# Altium schematic sheet 0270_GDDR6 VDD POL VREG.SchDoc
size 848 x 558 mm
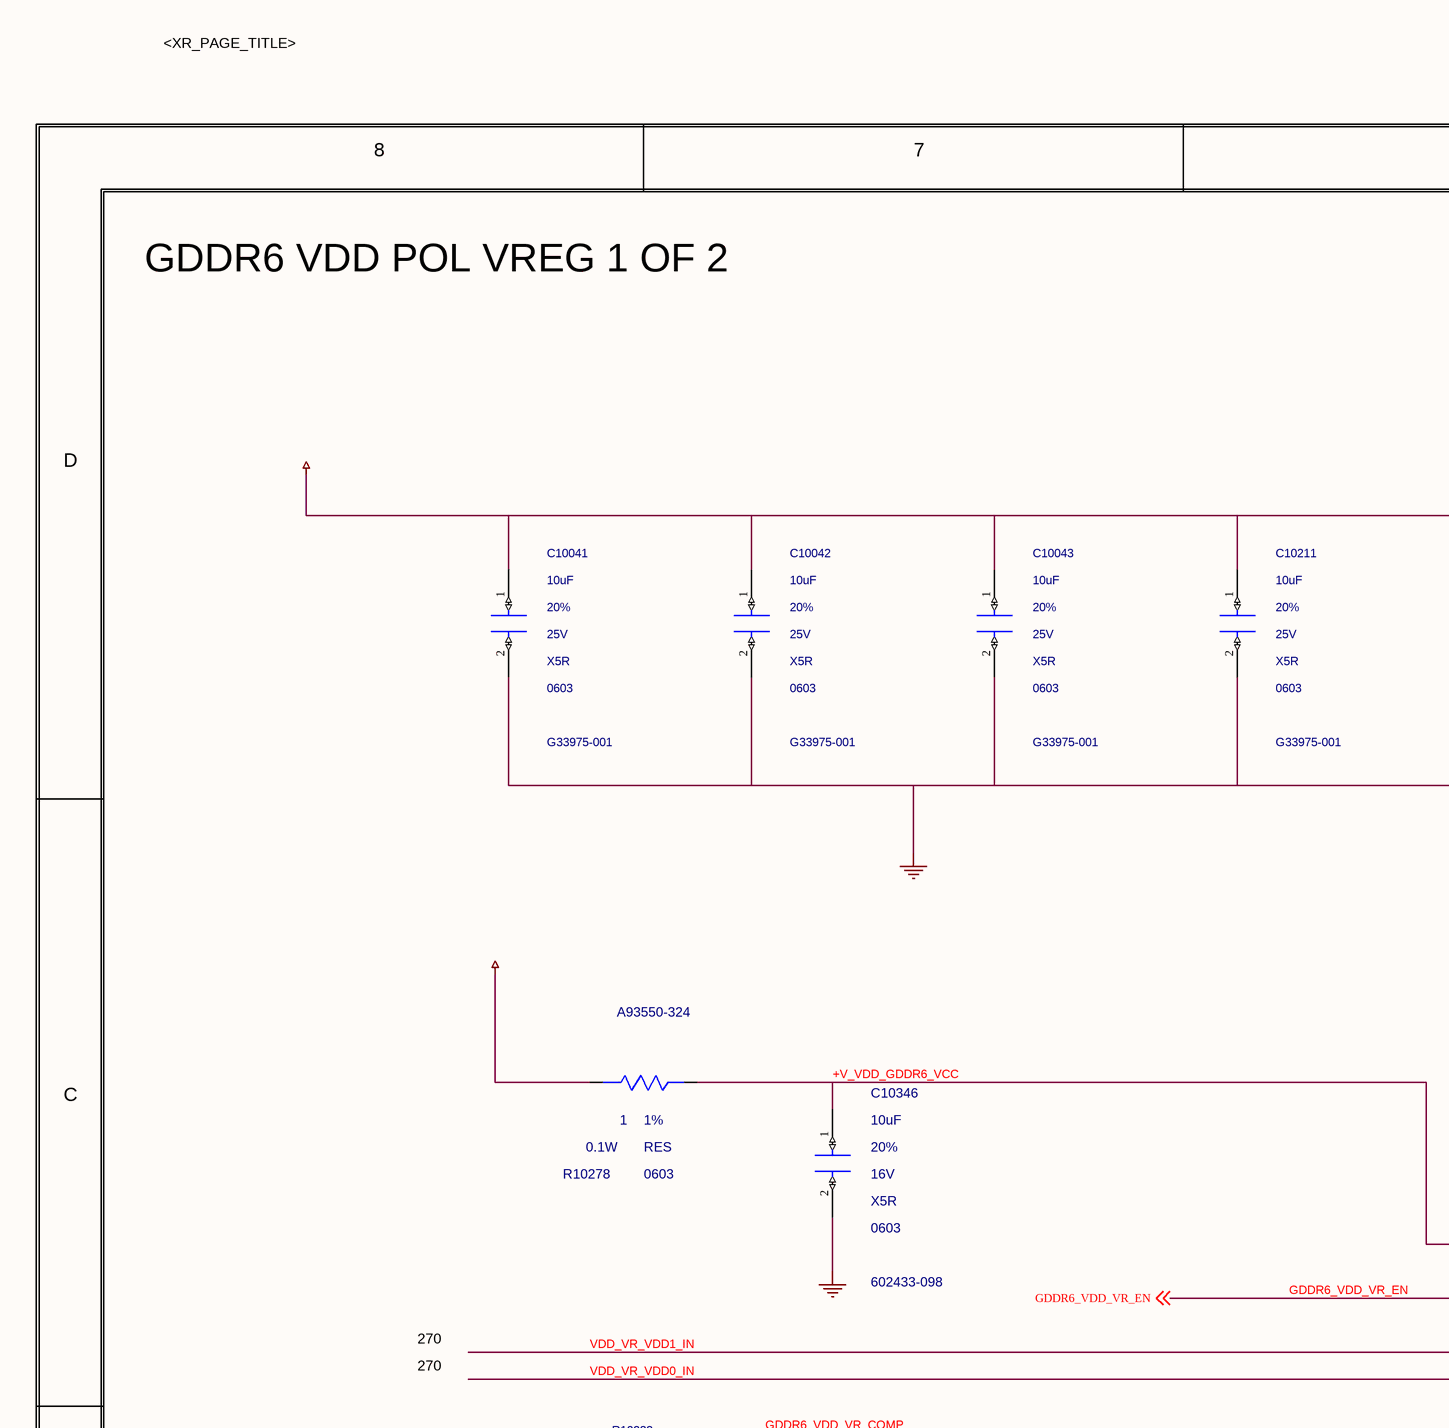
[diagram p0: 0270_GDDR6 VDD POL VREG.SchDoc, top left]
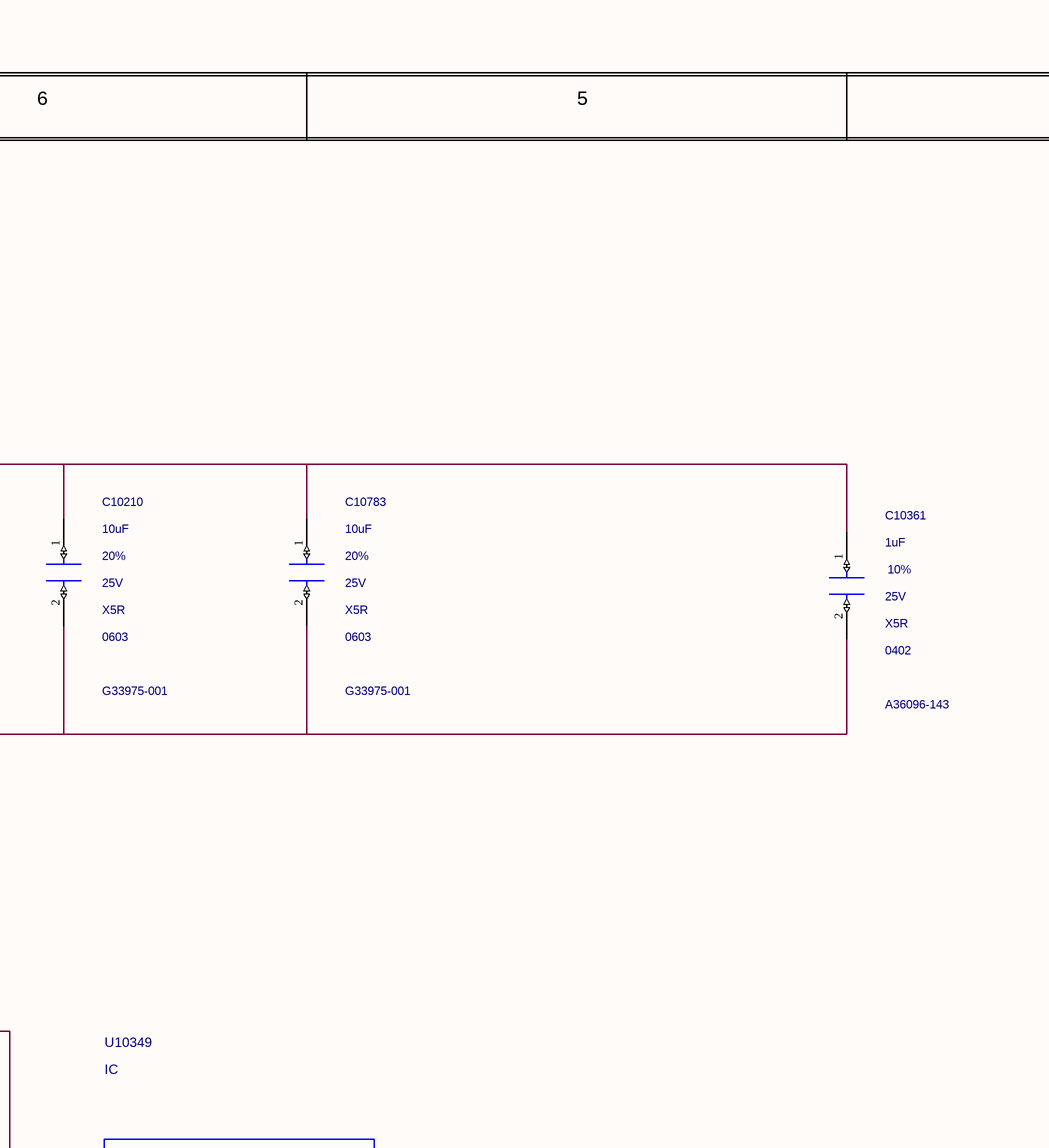
[diagram p1: 0270_GDDR6 VDD POL VREG.SchDoc, top middle]
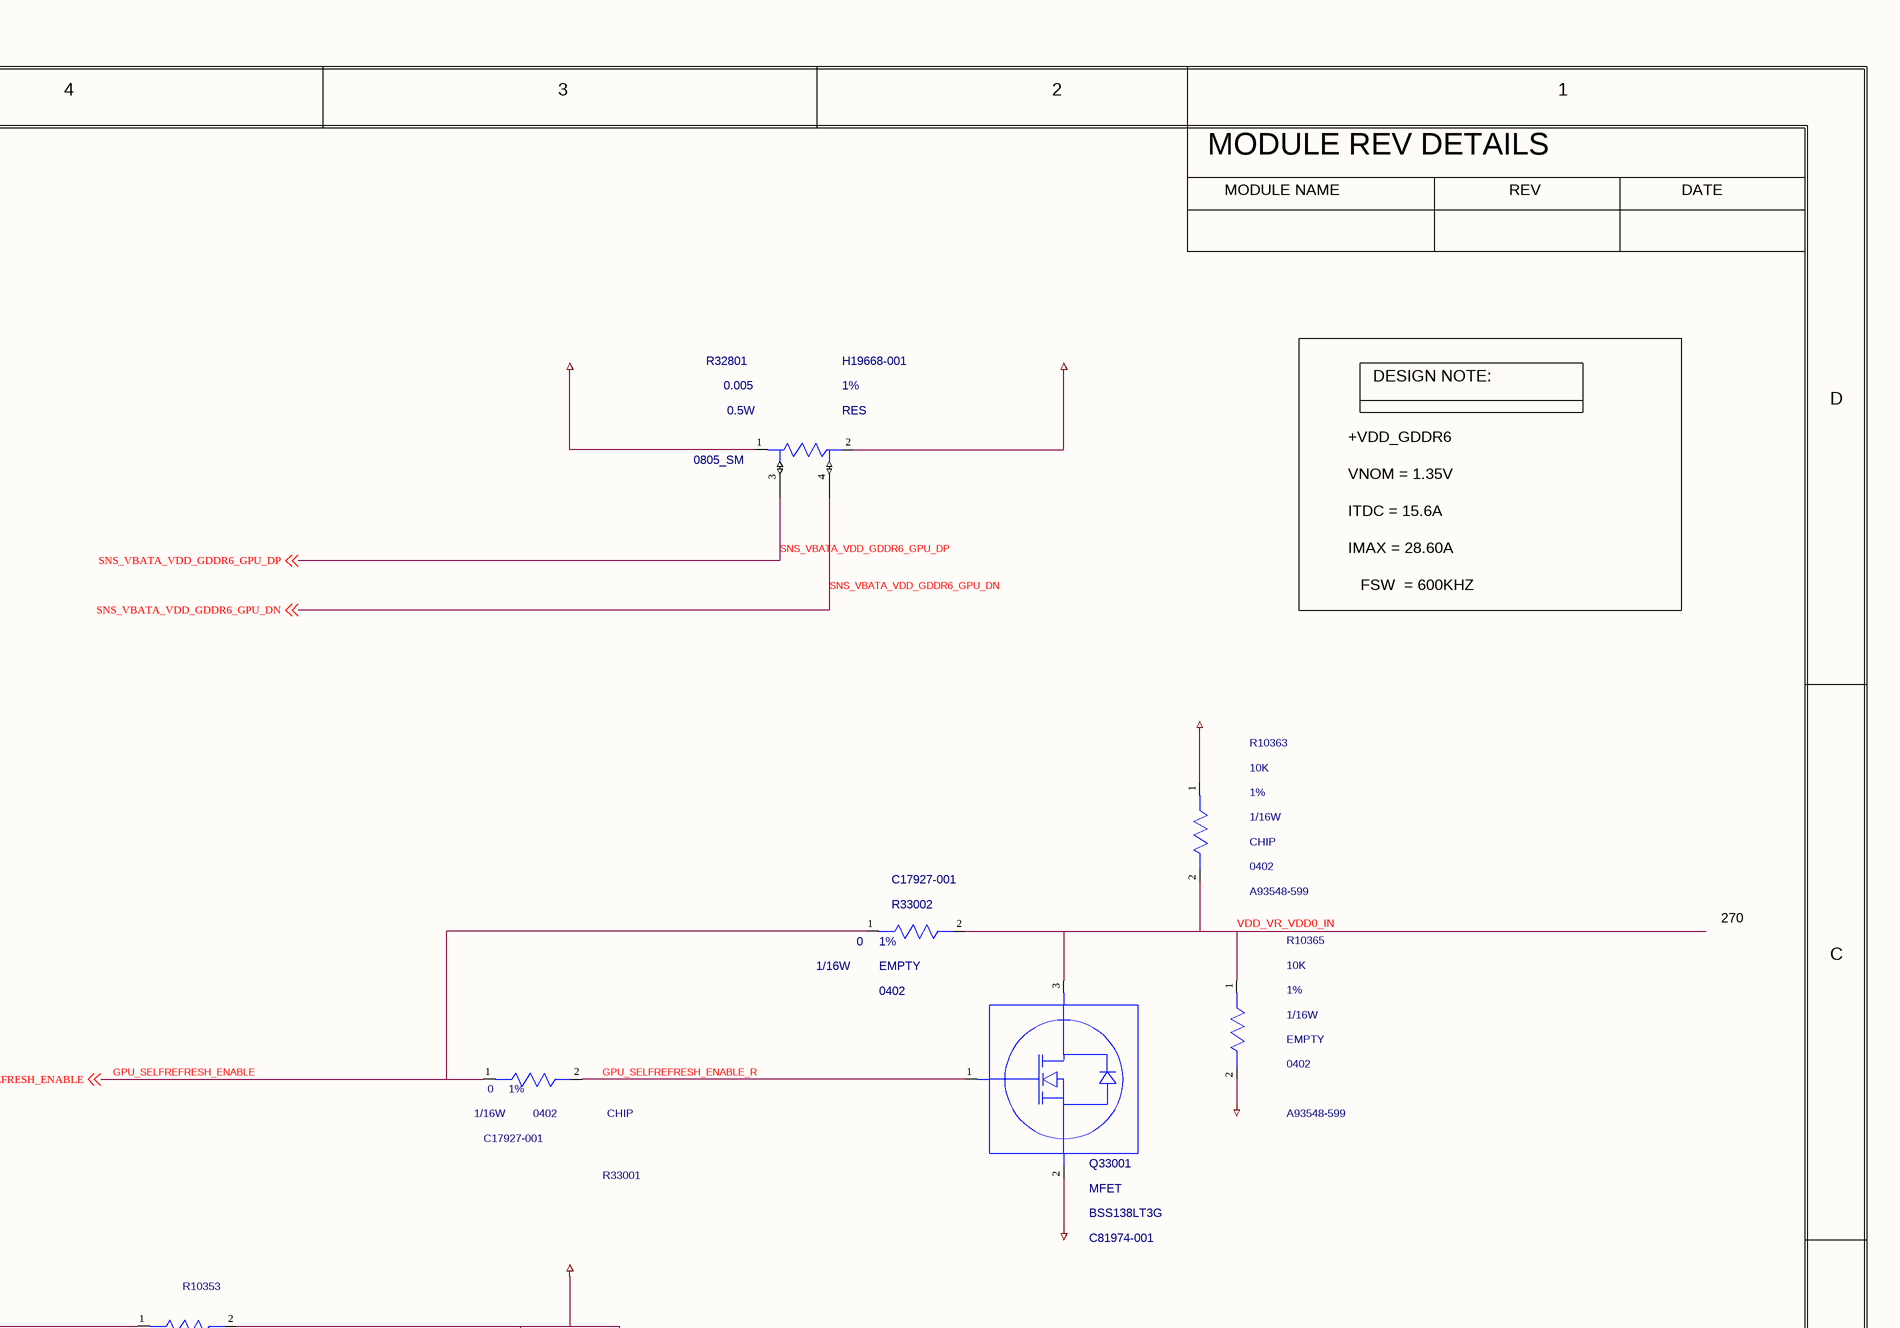
[diagram p2: 0270_GDDR6 VDD POL VREG.SchDoc, top right]
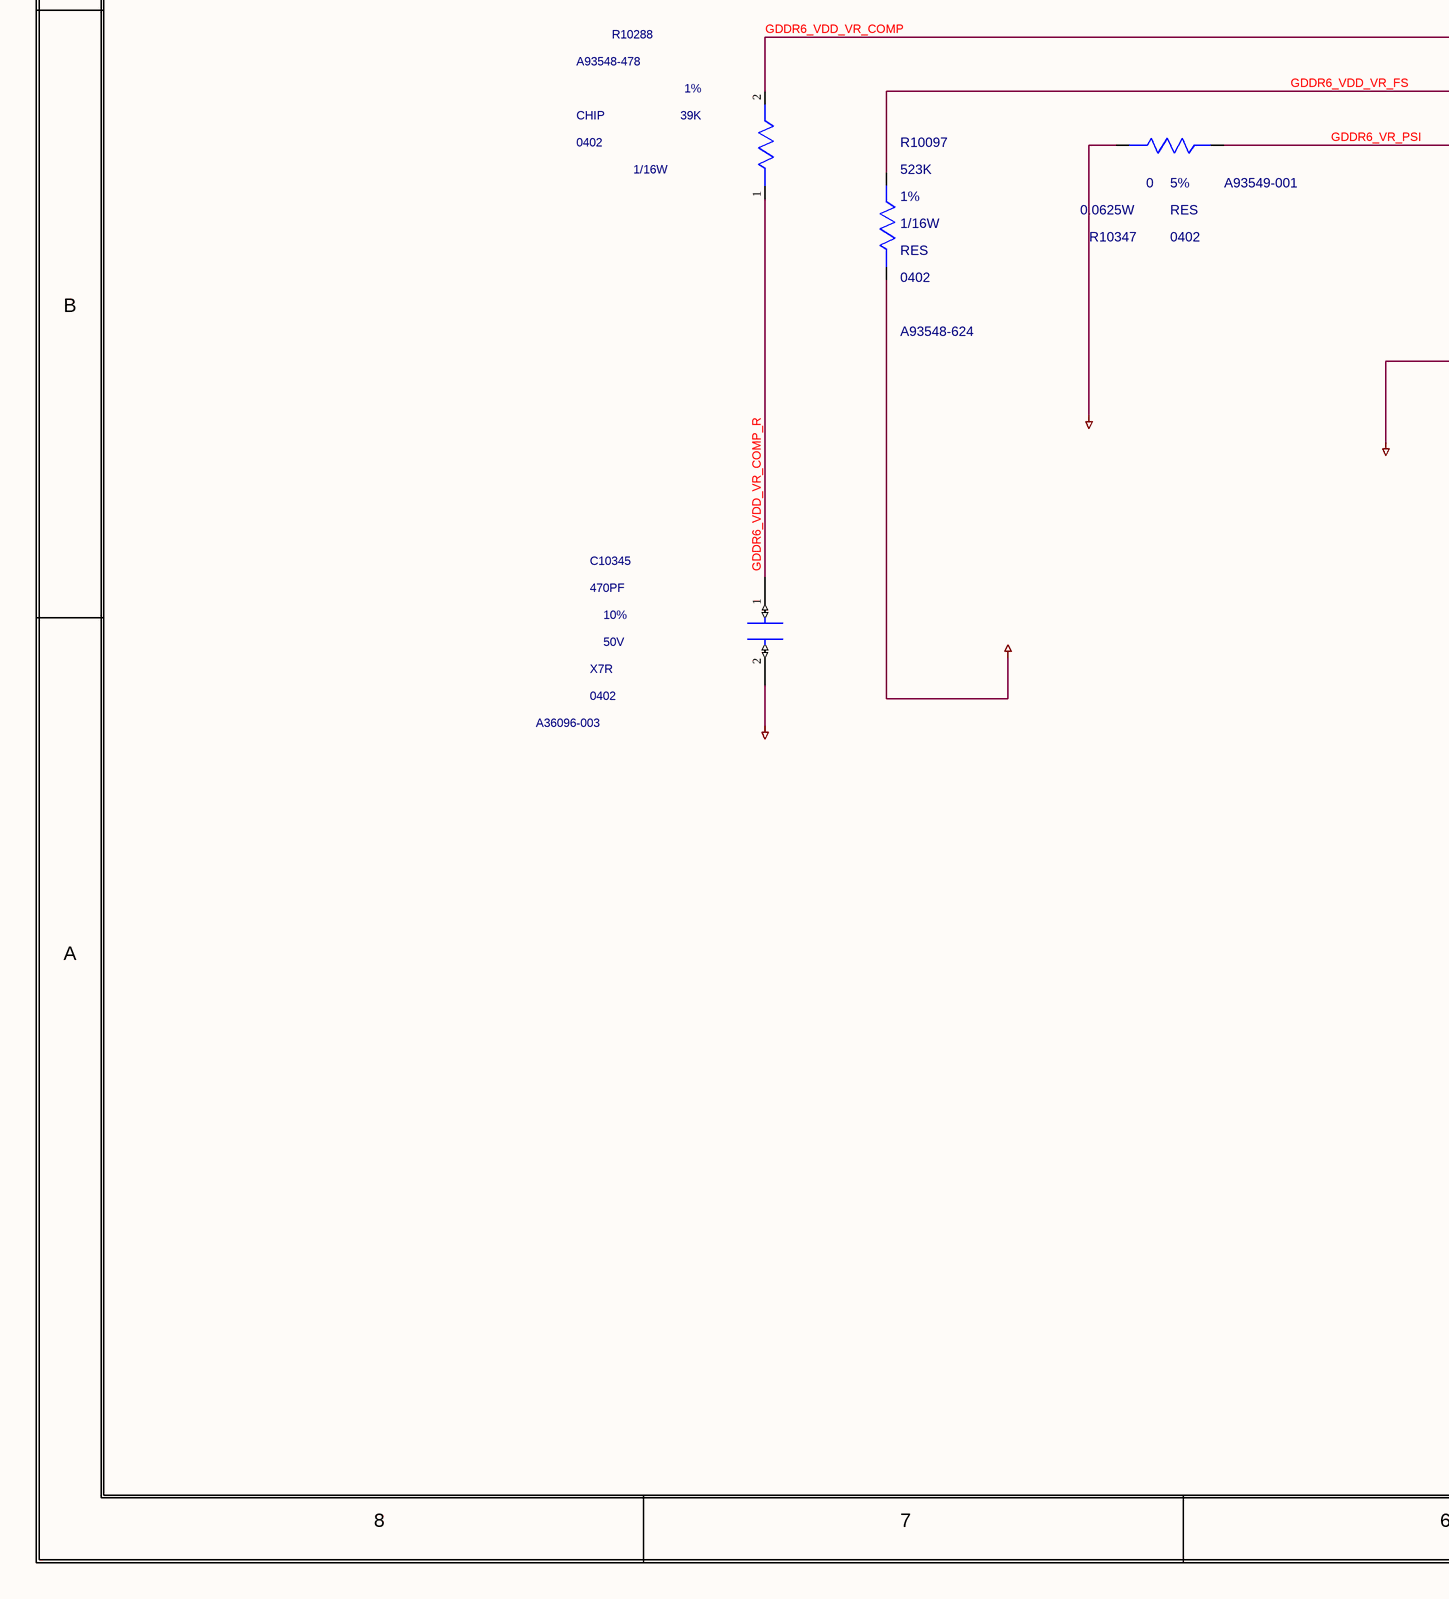
[diagram p3: 0270_GDDR6 VDD POL VREG.SchDoc, bottom left]
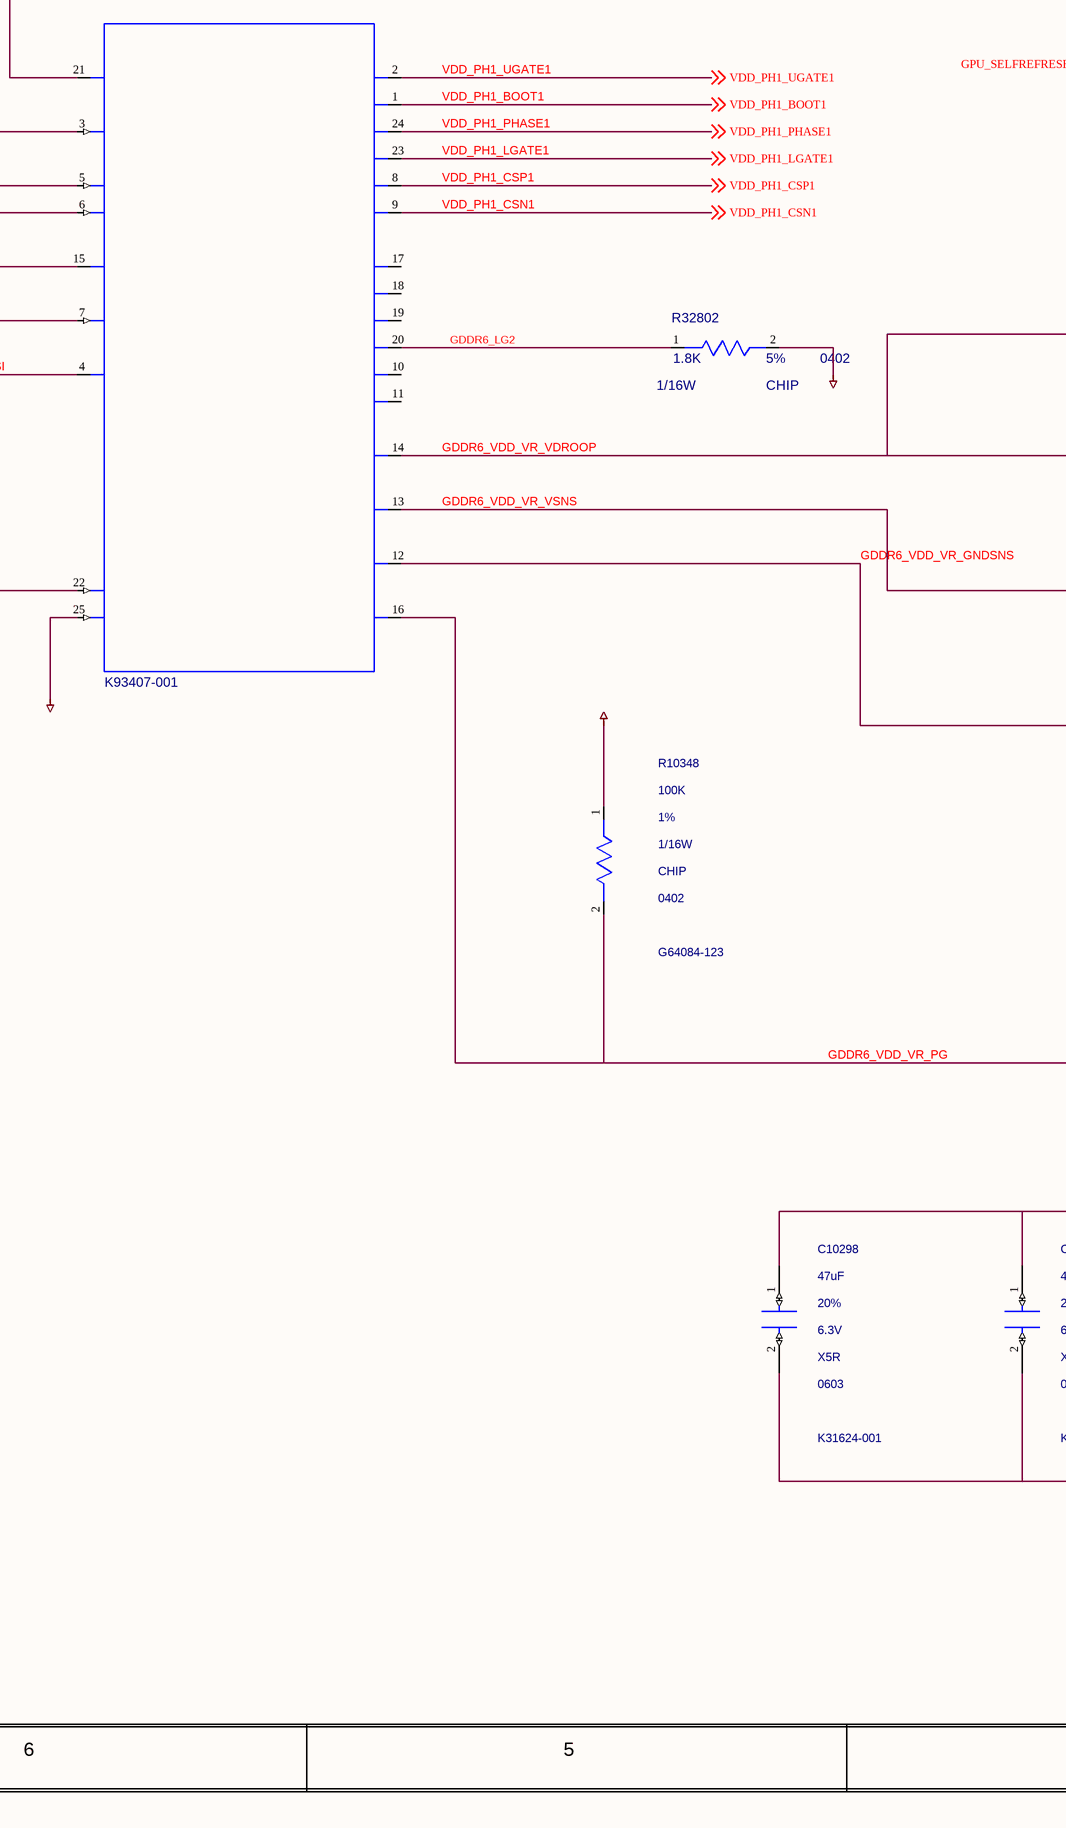
[diagram p4: 0270_GDDR6 VDD POL VREG.SchDoc, bottom middle]
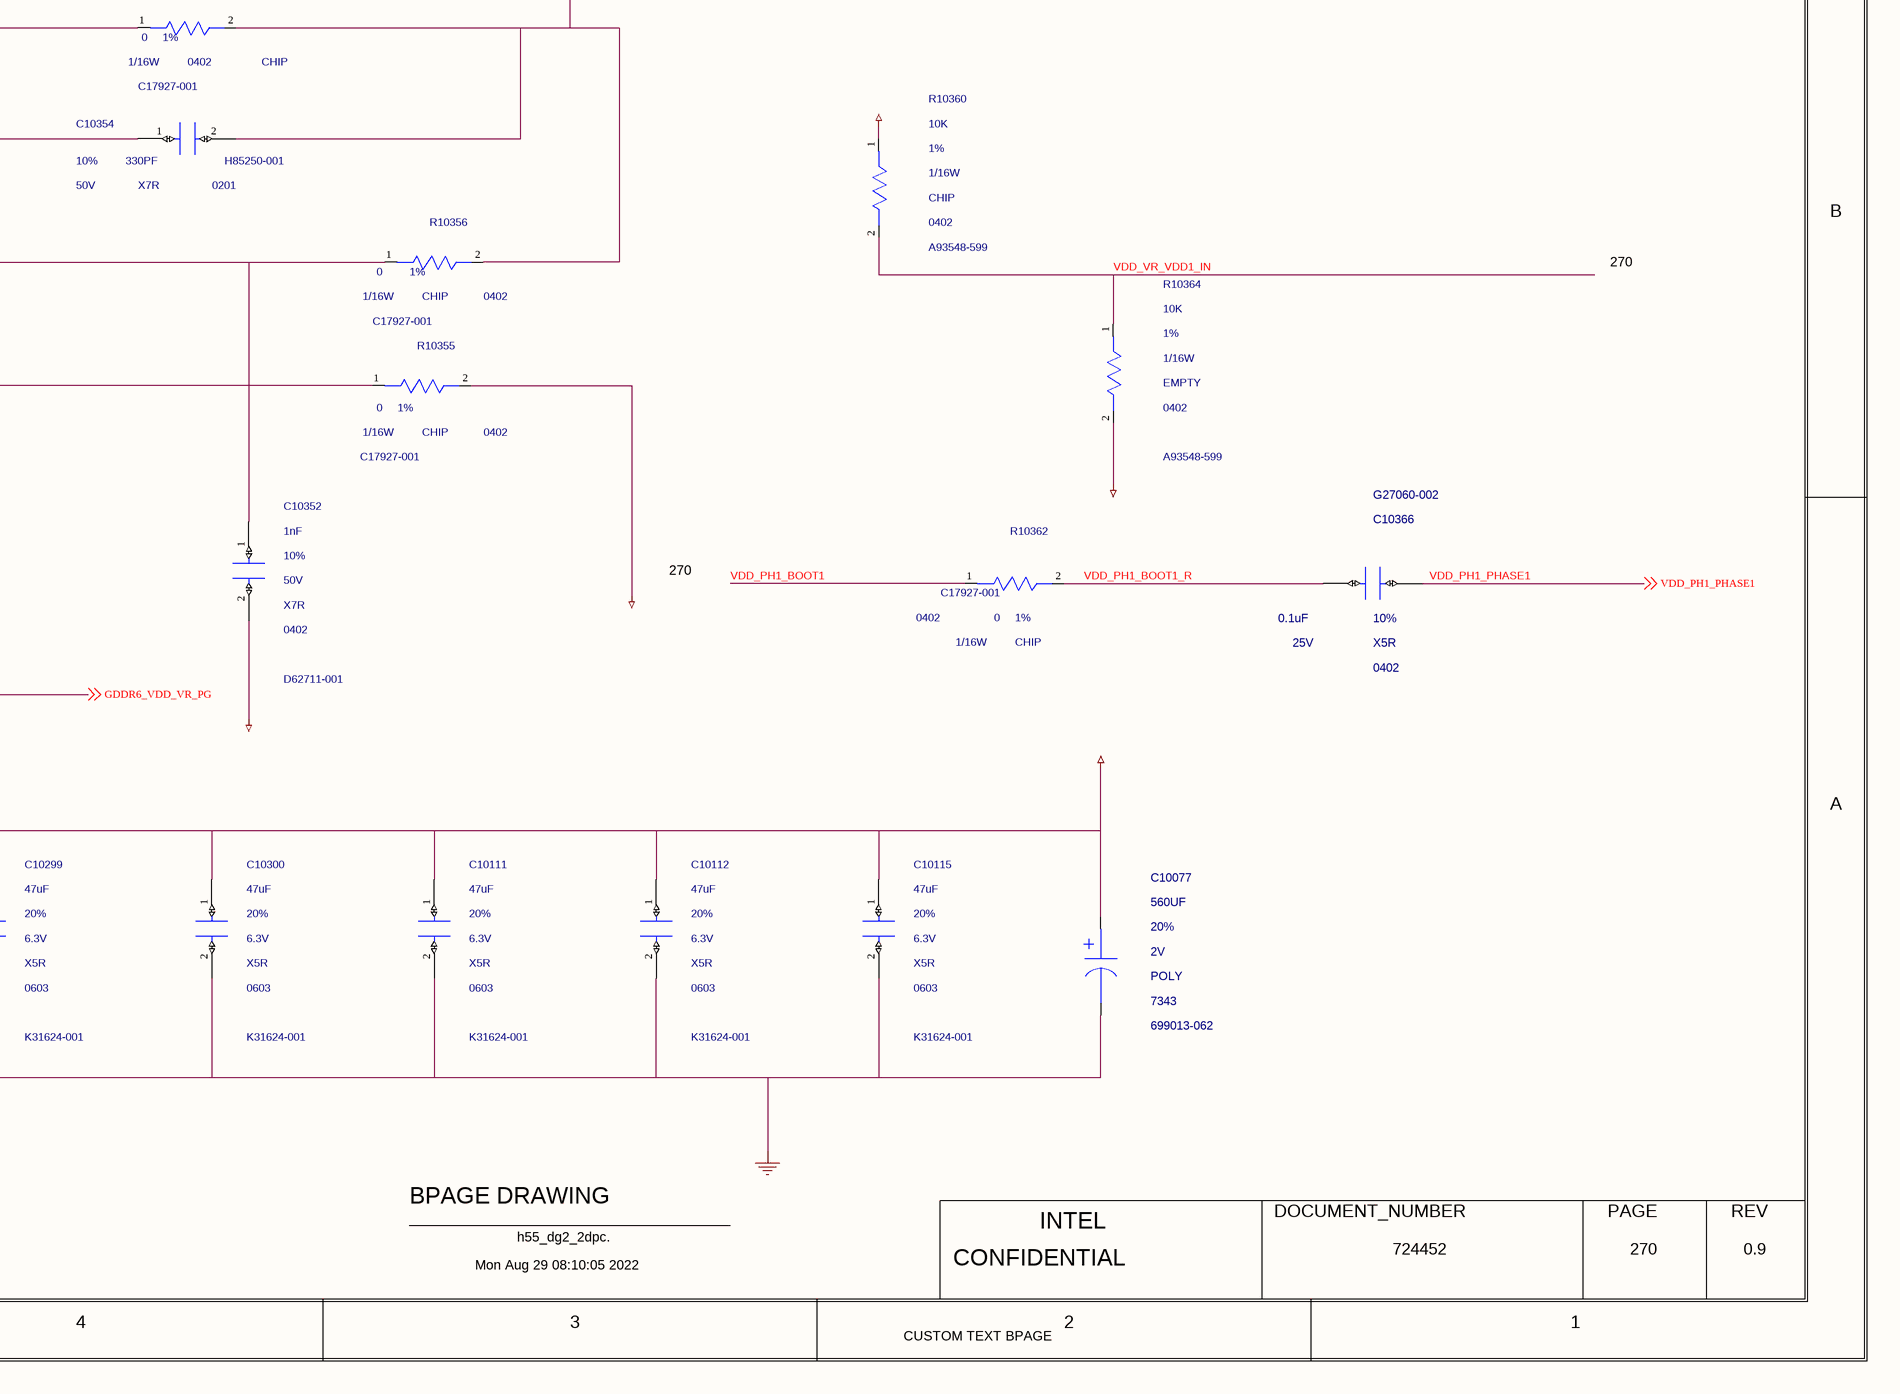
[diagram p5: 0270_GDDR6 VDD POL VREG.SchDoc, bottom right]

## Parts
C10041  10uF  MATERIAL: X5R  PACK_TYPE: 0603  PART_NUMBER: G33975-001  TOLERANCE: 20%  VOLTAGE: 25V  [SMC0603IA]
C10042  10uF  MATERIAL: X5R  PACK_TYPE: 0603  PART_NUMBER: G33975-001  TOLERANCE: 20%  VOLTAGE: 25V  [SMC0603IA]
C10043  10uF  MATERIAL: X5R  PACK_TYPE: 0603  PART_NUMBER: G33975-001  TOLERANCE: 20%  VOLTAGE: 25V  [SMC0603IA]
C10077  560UF  MATERIAL: POLY  PACK_TYPE: 7343  PART_NUMBER: 699013-062  TOLERANCE: 20%  VOLTAGE: 2V  [CTK2_SMC7343M_7500X4500_TANT_MA]
C10111  47uF  MATERIAL: X5R  PACK_TYPE: 0603  PART_NUMBER: K31624-001  TOLERANCE: 20%  VOLTAGE: 6.3V  [SMC0603ID]
C10112  47uF  MATERIAL: X5R  PACK_TYPE: 0603  PART_NUMBER: K31624-001  TOLERANCE: 20%  VOLTAGE: 6.3V  [SMC0603ID]
C10115  47uF  MATERIAL: X5R  PACK_TYPE: 0603  PART_NUMBER: K31624-001  TOLERANCE: 20%  VOLTAGE: 6.3V  [SMC0603ID]
C10210  10uF  MATERIAL: X5R  PACK_TYPE: 0603  PART_NUMBER: G33975-001  TOLERANCE: 20%  VOLTAGE: 25V  [SMC0603IA]
C10211  10uF  MATERIAL: X5R  PACK_TYPE: 0603  PART_NUMBER: G33975-001  TOLERANCE: 20%  VOLTAGE: 25V  [SMC0603IA]
C10298  47uF  MATERIAL: X5R  PACK_TYPE: 0603  PART_NUMBER: K31624-001  TOLERANCE: 20%  VOLTAGE: 6.3V  [SMC0603ID]
C10299  47uF  MATERIAL: X5R  PACK_TYPE: 0603  PART_NUMBER: K31624-001  TOLERANCE: 20%  VOLTAGE: 6.3V  [SMC0603ID]
C10300  47uF  MATERIAL: X5R  PACK_TYPE: 0603  PART_NUMBER: K31624-001  TOLERANCE: 20%  VOLTAGE: 6.3V  [SMC0603ID]
C10345  470PF  MATERIAL: X7R  PACK_TYPE: 0402  PART_NUMBER: A36096-003  TOLERANCE: 10%  VOLTAGE: 50V  [SMC0402IA]
C10346  10uF  MATERIAL: X5R  PACK_TYPE: 0603  PART_NUMBER: 602433-098  TOLERANCE: 20%  VOLTAGE: 16V  [SMC0603IA]
C10352  1nF  MATERIAL: X7R  PACK_TYPE: 0402  PART_NUMBER: D62711-001  TOLERANCE: 10%  VOLTAGE: 50V  [SMC0402IA]
C10354  330PF  MATERIAL: X7R  PACK_TYPE: 0201  PART_NUMBER: H85250-001  TOLERANCE: 10%  VOLTAGE: 50V  [SMC0201MB]
C10361  1uF  MATERIAL: X5R  PACK_TYPE: 0402  PART_NUMBER: A36096-143  TOLERANCE: 10%  VOLTAGE: 25V  [SMC0402MA]
C10366  0.1uF  MATERIAL: X5R  PACK_TYPE: 0402  PART_NUMBER: G27060-002  TOLERANCE: 10%  VOLTAGE: 25V  [CTK2_SM0402_1050X550_MA]
C10783  10uF  MATERIAL: X5R  PACK_TYPE: 0603  PART_NUMBER: G33975-001  TOLERANCE: 20%  VOLTAGE: 25V  [SMC0603IA]
Q33001  BSS138LT3G  MATERIAL: MFET  PART_NUMBER: C81974-001  [CTK0_SOT23_1400X3040_950_MA]
R10097  523K  MATERIAL: RES  PACK_TYPE: 0402  PART_NUMBER: A93548-624  TOLERANCE: 1%  WATTAGE: 1/16W  [TK2_SM0402_1050X550_MA]
R10278  1  MATERIAL: RES  PACK_TYPE: 0603  PART_NUMBER: A93550-324  TOLERANCE: 1%  WATTAGE: 0.1W  [CTK2_SM0603_1800X900_MA]
R10288  39K  MATERIAL: CHIP  PACK_TYPE: 0402  PART_NUMBER: A93548-478  TOLERANCE: 1%  WATTAGE: 1/16W  [SMR0402IA]
R10347  0  MATERIAL: RES  PACK_TYPE: 0402  PART_NUMBER: A93549-001  TOLERANCE: 5%  WATTAGE: 0.0625W  [CTK2_SM0402_1100X550_MA]
R10348  100K  MATERIAL: CHIP  PACK_TYPE: 0402  PART_NUMBER: G64084-123  TOLERANCE: 1%  WATTAGE: 1/16W  [SMR0402IA]
R10353  0  MATERIAL: CHIP  PACK_TYPE: 0402  PART_NUMBER: C17927-001  TOLERANCE: 1%  WATTAGE: 1/16W  [SMR0402IA]
R10355  0  MATERIAL: CHIP  PACK_TYPE: 0402  PART_NUMBER: C17927-001  TOLERANCE: 1%  WATTAGE: 1/16W  [SMR0402IA]
R10356  0  MATERIAL: CHIP  PACK_TYPE: 0402  PART_NUMBER: C17927-001  TOLERANCE: 1%  WATTAGE: 1/16W  [SMR0402IA]
R10360  10K  MATERIAL: CHIP  PACK_TYPE: 0402  PART_NUMBER: A93548-599  TOLERANCE: 1%  WATTAGE: 1/16W  [SMR0402IA]
R10362  0  MATERIAL: CHIP  PACK_TYPE: 0402  PART_NUMBER: C17927-001  TOLERANCE: 1%  WATTAGE: 1/16W  [SMR0402IA]
R10363  10K  MATERIAL: CHIP  PACK_TYPE: 0402  PART_NUMBER: A93548-599  TOLERANCE: 1%  WATTAGE: 1/16W  [SMR0402IA]
R10364  10K  MATERIAL: EMPTY  PACK_TYPE: 0402  PART_NUMBER: A93548-599  TOLERANCE: 1%  WATTAGE: 1/16W  [SMR0402IA]
R10365  10K  MATERIAL: EMPTY  PACK_TYPE: 0402  PART_NUMBER: A93548-599  TOLERANCE: 1%  WATTAGE: 1/16W  [SMR0402IA]
R32801  0.005  MATERIAL: RES  PACK_TYPE: 0805_SM  PART_NUMBER: H19668-001  TOLERANCE: 1%  WATTAGE: 0.5W  [CTK2_SMR4_0805_2150X1350_MA]
R32802  1.8K  MATERIAL: CHIP  PACK_TYPE: 0402  TOLERANCE: 5%  WATTAGE: 1/16W  [SMR1005MD]
R33001  0  MATERIAL: CHIP  PACK_TYPE: 0402  PART_NUMBER: C17927-001  TOLERANCE: 1%  WATTAGE: 1/16W  [SMR0402IA]
R33002  0  MATERIAL: EMPTY  PACK_TYPE: 0402  PART_NUMBER: C17927-001  TOLERANCE: 1%  WATTAGE: 1/16W  [SMR0402IA]
U10349  MATERIAL: IC  PART_NUMBER: K93407-001  [TK0_LCC24_S4100_500_DFS2650_MA]  (hidden comment: APW8751_2)

## Nets
+V1P8S_GPU: R10348.1(A) R10360.1(A) R10363.1(A)
+V5A_L: R10278.1(A)
+VBATA_DG2: R32801.1(PWRA)
+VBATA_VDD_GDDR6: C10041.1(A) C10042.1(A) C10043.1(A) C10210.1(A) C10211.1(A) C10361.1(A) C10783.1(A) R10097.2(B) R32801.2(PWRB)
+VDD_GDDR6: C10077.1(A) C10111.1(A) C10112.1(A) C10115.1(A) C10298.1(A) C10299.1(A) C10300.1(A) C10354.2(B) R10353.2(B) R10356.2(B)
GND: C10041.2(B) C10042.2(B) C10043.2(B) C10077.2(B) C10111.2(B) C10112.2(B) C10115.2(B) C10210.2(B) C10211.2(B) C10298.2(B) C10299.2(B) C10300.2(B) C10345.2(B) C10346.2(B) C10352.2(B) C10361.2(B) C10783.2(B) Q33001.2(S) R10347.1(A) R10355.2(B) R10364.2(B) R10365.2(B) R32802.2(B) U10349.22(GND) U10349.25(PGND_TPD)
+V_VDD_GDDR6_VCC: C10346.1(A) R10278.2(B) U10349.21(VCC)
GDDR6_LG2: R32802.1(A) U10349.20(LGATE2)
GDDR6_VDD_VR_COMP: R10288.2(B) U10349.15(COMP)
GDDR6_VDD_VR_COMP_R: C10345.1(A) R10288.1(A)
GDDR6_VDD_VR_EN: U10349.3(EN) ; off-sheet GDDR6_VDD_VR_EN
GDDR6_VDD_VR_FS: R10097.1(A) U10349.7(FS)
GDDR6_VDD_VR_GNDSNS: R10355.1(A) U10349.12(GNDSNS)
GDDR6_VDD_VR_PG: R10348.2(B) U10349.16(POK) ; off-sheet GDDR6_VDD_VR_PG
GDDR6_VDD_VR_VDROOP: C10354.1(A) R10353.1(A) U10349.14(VDROOP)
GDDR6_VDD_VR_VSNS: C10352.1(A) R10356.1(A) U10349.13(VSNS)
GDDR6_VR_PSI: R10347.2(B) U10349.4(PSI)
GPU_SELFREFRESH_ENABLE: R33001.1(A) R33002.1(A) ; off-sheet GPU_SELFREFRESH_ENABLE
GPU_SELFREFRESH_ENABLE_R: Q33001.1(G) R33001.2(B)
SNS_VBATA_VDD_GDDR6_GPU_DN: R32801.4(SENB) ; off-sheet SNS_VBATA_VDD_GDDR6_GPU_DN
SNS_VBATA_VDD_GDDR6_GPU_DP: R32801.3(SENA) ; off-sheet SNS_VBATA_VDD_GDDR6_GPU_DP
VDD_PH1_BOOT1: R10362.1(A) U10349.1(BOOT1) ; off-sheet VDD_PH1_BOOT1
VDD_PH1_BOOT1_R: C10366.1(A) R10362.2(B)
VDD_PH1_CSN1: U10349.9(CSN1) ; off-sheet VDD_PH1_CSN1
VDD_PH1_CSP1: U10349.8(CSP1) ; off-sheet VDD_PH1_CSP1
VDD_PH1_LGATE1: U10349.23(LGATE1) ; off-sheet VDD_PH1_LGATE1
VDD_PH1_PHASE1: C10366.2(B) U10349.24(PHASE1) ; off-sheet VDD_PH1_PHASE1
VDD_PH1_UGATE1: U10349.2(UGATE1) ; off-sheet VDD_PH1_UGATE1
VDD_VR_VDD0_IN: Q33001.3(D) R10363.2(B) R10365.1(A) R33002.2(B) U10349.6(VID0)
VDD_VR_VDD1_IN: R10360.2(B) R10364.1(A) U10349.5(VID1)

Not connected (* = marked no-connect by the designer): U10349 10(CSP2) 11(CSN2) 17(UGATE2) 18(BOOT2) 19(PHASE2)

## Notes on the sheet
- <XR_PAGE_TITLE>
- 8
- 7
- 6
- 5
- 4
- 3
- 2
- 1
- MODULE REV DETAILS
- GDDR6 VDD POL VREG 1 OF 2
- MODULE NAME
- REV
- DATE
- D
- DESIGN NOTE:
- +VDD_GDDR6
- VNOM = 1.35V
- ITDC = 15.6A
- IMAX = 28.60A
- FSW  = 600KHZ
- 270
- C
- B
- A
- BPAGE DRAWING
- INTEL
- DOCUMENT_NUMBER
- PAGE
- Mon Aug 29 08:10:05 2022
- h55_dg2_2dpc.
- CONFIDENTIAL
- 724452
- 0.9
- CUSTOM TEXT BPAGE

## Library data of the parts
C10041 = CAP: CDS_PHYS_PART_NAME: CAP_0603-G33975-001,X5R,10UF,25V,20%,LPDB,GENERIC; OriginalSymbolOrigin: (-50,25); XY: (-7250,4200); VER: 1; ROT: 0; PHYS_PAGE: 270; LOCATION: C10041; DRAWING: @RVP1_ADL_SB_ADP_S_DDR5_SODIMM_2DPC_LIB.H55_DG2_2DPC(SCH_1):PAGE443; CDS_LIB: discrete; PCB Footprint: SMC0603IA; CHIPS_PART_NAME: CAP; CDS_PART_NAME: CAP_0603-G33975-001,X5R,10UF,25V,20%,LPDB,GENERIC; CDS_LOCATION: C10041
C10042 = CAP: CDS_PHYS_PART_NAME: CAP_0603-G33975-001,X5R,10UF,25V,20%,LPDB,GENERIC; OriginalSymbolOrigin: (-50,25); XY: (-6800,4200); VER: 1; ROT: 0; PHYS_PAGE: 270; LOCATION: C10042; DRAWING: @RVP1_ADL_SB_ADP_S_DDR5_SODIMM_2DPC_LIB.H55_DG2_2DPC(SCH_1):PAGE443; CDS_LIB: discrete; PCB Footprint: SMC0603IA; CHIPS_PART_NAME: CAP; CDS_PART_NAME: CAP_0603-G33975-001,X5R,10UF,25V,20%,LPDB,GENERIC; CDS_LOCATION: C10042
C10043 = CAP: CDS_PHYS_PART_NAME: CAP_0603-G33975-001,X5R,10UF,25V,20%,LPDB,GENERIC; OriginalSymbolOrigin: (-50,25); XY: (-6350,4200); VER: 1; ROT: 0; PHYS_PAGE: 270; LOCATION: C10043; DRAWING: @RVP1_ADL_SB_ADP_S_DDR5_SODIMM_2DPC_LIB.H55_DG2_2DPC(SCH_1):PAGE443; CDS_LIB: discrete; PCB Footprint: SMC0603IA; CHIPS_PART_NAME: CAP; CDS_PART_NAME: CAP_0603-G33975-001,X5R,10UF,25V,20%,LPDB,GENERIC; CDS_LOCATION: C10043
C10077 = C_CAPP: CDS_PHYS_PART_NAME: C_CAPP_7343-699013-062,POLY,560UF,2V,20%,TK2,GENERIC; CDS_LMAN_SYM_OUTLINE: -50,100,50,-50; FP_TECH: TK2; IP: GENERIC; ROOM: NONE; OriginalSymbolOrigin: (-50,75); XY: (-1425,675); VER: 1; ROT: 0; PHYS_PAGE: 270; LOCATION: C10077; DRAWING: @RVP1_ADL_SB_ADP_S_DDR5_SODIMM_2DPC_LIB.H55_DG2_2DPC(SCH_1):PAGE443; CDS_LIB: c_discrete; VARIANT: ?; PCB Footprint: CTK2_SMC7343M_7500X4500_TANT_MA; CHIPS_PART_NAME: C_CAPP; CDS_PART_NAME: C_CAPP_7343-699013-062,POLY,560UF,2V,20%,TK2,GENERIC; CDS_LOCATION: C10077
C10111 = CAP: CDS_PHYS_PART_NAME: CAP_0603-K31624-001,X5R,47UF,6.3V,20%,LPDB,GENERIC; OriginalSymbolOrigin: (-50,25); XY: (-2775,750); VER: 1; ROT: 0; PHYS_PAGE: 270; LOCATION: C10111; DRAWING: @RVP1_ADL_SB_ADP_S_DDR5_SODIMM_2DPC_LIB.H55_DG2_2DPC(SCH_1):PAGE443; CDS_LIB: discrete; PCB Footprint: SMC0603ID; CHIPS_PART_NAME: CAP; CDS_PART_NAME: CAP_0603-K31624-001,X5R,47UF,6.3V,20%,LPDB,GENERIC; CDS_LOCATION: C10111
C10112 = CAP: CDS_PHYS_PART_NAME: CAP_0603-K31624-001,X5R,47UF,6.3V,20%,LPDB,GENERIC; OriginalSymbolOrigin: (-50,25); XY: (-2325,750); VER: 1; ROT: 0; PHYS_PAGE: 270; LOCATION: C10112; DRAWING: @RVP1_ADL_SB_ADP_S_DDR5_SODIMM_2DPC_LIB.H55_DG2_2DPC(SCH_1):PAGE443; CDS_LIB: discrete; PCB Footprint: SMC0603ID; CHIPS_PART_NAME: CAP; CDS_PART_NAME: CAP_0603-K31624-001,X5R,47UF,6.3V,20%,LPDB,GENERIC; CDS_LOCATION: C10112
C10115 = CAP: CDS_PHYS_PART_NAME: CAP_0603-K31624-001,X5R,47UF,6.3V,20%,LPDB,GENERIC; OriginalSymbolOrigin: (-50,25); XY: (-1875,750); VER: 1; ROT: 0; PHYS_PAGE: 270; LOCATION: C10115; DRAWING: @RVP1_ADL_SB_ADP_S_DDR5_SODIMM_2DPC_LIB.H55_DG2_2DPC(SCH_1):PAGE443; CDS_LIB: discrete; PCB Footprint: SMC0603ID; CHIPS_PART_NAME: CAP; CDS_PART_NAME: CAP_0603-K31624-001,X5R,47UF,6.3V,20%,LPDB,GENERIC; CDS_LOCATION: C10115
C10210 = CAP: CDS_PHYS_PART_NAME: CAP_0603-G33975-001,X5R,10UF,25V,20%,LPDB,GENERIC; OriginalSymbolOrigin: (-50,25); XY: (-5450,4200); VER: 1; ROT: 0; PHYS_PAGE: 270; LOCATION: C10210; DRAWING: @RVP1_ADL_SB_ADP_S_DDR5_SODIMM_2DPC_LIB.H55_DG2_2DPC(SCH_1):PAGE443; CDS_LIB: discrete; PCB Footprint: SMC0603IA; CHIPS_PART_NAME: CAP; CDS_PART_NAME: CAP_0603-G33975-001,X5R,10UF,25V,20%,LPDB,GENERIC; CDS_LOCATION: C10210
C10211 = CAP: CDS_PHYS_PART_NAME: CAP_0603-G33975-001,X5R,10UF,25V,20%,LPDB,GENERIC; OriginalSymbolOrigin: (-50,25); XY: (-5900,4200); VER: 1; ROT: 0; PHYS_PAGE: 270; LOCATION: C10211; DRAWING: @RVP1_ADL_SB_ADP_S_DDR5_SODIMM_2DPC_LIB.H55_DG2_2DPC(SCH_1):PAGE443; CDS_LIB: discrete; PCB Footprint: SMC0603IA; CHIPS_PART_NAME: CAP; CDS_PART_NAME: CAP_0603-G33975-001,X5R,10UF,25V,20%,LPDB,GENERIC; CDS_LOCATION: C10211
C10298 = CAP: CDS_PHYS_PART_NAME: CAP_0603-K31624-001,X5R,47UF,6.3V,20%,LPDB,GENERIC; OriginalSymbolOrigin: (-50,25); XY: (-4125,750); VER: 1; ROT: 0; PHYS_PAGE: 270; LOCATION: C10298; DRAWING: @RVP1_ADL_SB_ADP_S_DDR5_SODIMM_2DPC_LIB.H55_DG2_2DPC(SCH_1):PAGE443; CDS_LIB: discrete; PCB Footprint: SMC0603ID; CHIPS_PART_NAME: CAP; CDS_PART_NAME: CAP_0603-K31624-001,X5R,47UF,6.3V,20%,LPDB,GENERIC; CDS_LOCATION: C10298
C10299 = CAP: CDS_PHYS_PART_NAME: CAP_0603-K31624-001,X5R,47UF,6.3V,20%,LPDB,GENERIC; OriginalSymbolOrigin: (-50,25); XY: (-3675,750); VER: 1; ROT: 0; PHYS_PAGE: 270; LOCATION: C10299; DRAWING: @RVP1_ADL_SB_ADP_S_DDR5_SODIMM_2DPC_LIB.H55_DG2_2DPC(SCH_1):PAGE443; CDS_LIB: discrete; PCB Footprint: SMC0603ID; CHIPS_PART_NAME: CAP; CDS_PART_NAME: CAP_0603-K31624-001,X5R,47UF,6.3V,20%,LPDB,GENERIC; CDS_LOCATION: C10299
C10300 = CAP: CDS_PHYS_PART_NAME: CAP_0603-K31624-001,X5R,47UF,6.3V,20%,LPDB,GENERIC; OriginalSymbolOrigin: (-50,25); XY: (-3225,750); VER: 1; ROT: 0; PHYS_PAGE: 270; LOCATION: C10300; DRAWING: @RVP1_ADL_SB_ADP_S_DDR5_SODIMM_2DPC_LIB.H55_DG2_2DPC(SCH_1):PAGE443; CDS_LIB: discrete; PCB Footprint: SMC0603ID; CHIPS_PART_NAME: CAP; CDS_PART_NAME: CAP_0603-K31624-001,X5R,47UF,6.3V,20%,LPDB,GENERIC; CDS_LOCATION: C10300
C10345 = CAP: CDS_PHYS_PART_NAME: CAP_0402-A36096-003,X7R,470PF,50V,10%,LPDB,GENERIC; OriginalSymbolOrigin: (-50,25); XY: (-6775,1600); VER: 1; ROT: 0; PHYS_PAGE: 270; LOCATION: C10345; DRAWING: @RVP1_ADL_SB_ADP_S_DDR5_SODIMM_2DPC_LIB.H55_DG2_2DPC(SCH_1):PAGE443; CDS_LIB: discrete; PCB Footprint: SMC0402IA; CHIPS_PART_NAME: CAP; CDS_PART_NAME: CAP_0402-A36096-003,X7R,470PF,50V,10%,LPDB,GENERIC; CDS_LOCATION: C10345
C10346 = CAP: CDS_PHYS_PART_NAME: CAP_0603-602433-098,X5R,10UF,16V,20%,LPDB,GENERIC; OriginalSymbolOrigin: (-50,25); XY: (-6650,3200); VER: 1; ROT: 0; PHYS_PAGE: 270; LOCATION: C10346; DRAWING: @RVP1_ADL_SB_ADP_S_DDR5_SODIMM_2DPC_LIB.H55_DG2_2DPC(SCH_1):PAGE443; CDS_LIB: discrete; PCB Footprint: SMC0603IA; CHIPS_PART_NAME: CAP; CDS_PART_NAME: CAP_0603-602433-098,X5R,10UF,16V,20%,LPDB,GENERIC; CDS_LOCATION: C10346
C10352 = CAP: CDS_PHYS_PART_NAME: CAP_0402-D62711-001,X7R,1NF,50V,10%,LPDB,GENERIC; OriginalSymbolOrigin: (-50,25); XY: (-3150,1475); VER: 1; ROT: 0; PHYS_PAGE: 270; LOCATION: C10352; DRAWING: @RVP1_ADL_SB_ADP_S_DDR5_SODIMM_2DPC_LIB.H55_DG2_2DPC(SCH_1):PAGE443; CDS_LIB: discrete; PCB Footprint: SMC0402IA; CHIPS_PART_NAME: CAP; CDS_PART_NAME: CAP_0402-D62711-001,X7R,1NF,50V,10%,LPDB,GENERIC; CDS_LOCATION: C10352
C10354 = CAP: CDS_PHYS_PART_NAME: CAP_0201-H85250-001,X7R,330PF,50V,10%,LPDB,GENERIC; OriginalSymbolOrigin: (-50,25); XY: (-3275,2350); VER: 1; PHYS_PAGE: 270; LOCATION: C10354; DRAWING: @RVP1_ADL_SB_ADP_S_DDR5_SODIMM_2DPC_LIB.H55_DG2_2DPC(SCH_1):PAGE443; CDS_LIB: discrete; PCB Footprint: SMC0201MB; ROT: 1; CHIPS_PART_NAME: CAP; CDS_PART_NAME: CAP_0201-H85250-001,X7R,330PF,50V,10%,LPDB,GENERIC; CDS_LOCATION: C10354
C10361 = CAP: CDS_PHYS_PART_NAME: CAP_0402-A36096-143,X5R,1UF,25V,10%,LPDB,GENERIC; OriginalSymbolOrigin: (-50,25); XY: (-4000,4175); VER: 1; ROT: 0; PHYS_PAGE: 270; LOCATION: C10361; DRAWING: @RVP1_ADL_SB_ADP_S_DDR5_SODIMM_2DPC_LIB.H55_DG2_2DPC(SCH_1):PAGE443; CDS_LIB: discrete; PCB Footprint: SMC0402MA; CHIPS_PART_NAME: CAP; CDS_PART_NAME: CAP_0402-A36096-143,X5R,1UF,25V,10%,LPDB,GENERIC; CDS_LOCATION: C10361
C10366 = C_CAP#1: CHIPS_PART_NAME: C_CAP; CDS_PHYS_PART_NAME: C_CAP_0402-G27060-002,X5R,0.1UF,25V,10%,TK2,GENERIC; CDS_LMAN_SYM_OUTLINE: -50,50,50,-50; FP_TECH: TK2; IP: GENERIC; ROOM: NONE; OriginalSymbolOrigin: (-25,50); XY: (-875,1450); VER: 2; ROT: 0; PHYS_PAGE: 270; LOCATION: C10366; DRAWING: @RVP1_ADL_SB_ADP_S_DDR5_SODIMM_2DPC_LIB.H55_DG2_2DPC(SCH_1):PAGE443; CDS_LIB: c_discrete; VARIANT: ?; PCB Footprint: CTK2_SM0402_1050X550_MA; CDS_PART_NAME: C_CAP_0402-G27060-002,X5R,0.1UF,25V,10%,TK2,GENERIC; CDS_LOCATION: C10366
C10783 = CAP: CDS_PHYS_PART_NAME: CAP_0603-G33975-001,X5R,10UF,25V,20%,LPDB,GENERIC; OriginalSymbolOrigin: (-50,25); XY: (-5000,4200); VER: 1; ROT: 0; PHYS_PAGE: 270; LOCATION: C10783; DRAWING: @RVP1_ADL_SB_ADP_S_DDR5_SODIMM_2DPC_LIB.H55_DG2_2DPC(SCH_1):PAGE443; CDS_LIB: discrete; PCB Footprint: SMC0603IA; CHIPS_PART_NAME: CAP; CDS_PART_NAME: CAP_0603-G33975-001,X5R,10UF,25V,20%,LPDB,GENERIC; CDS_LOCATION: C10783
Q33001 = C_MOSFET_N#1: CDS_PHYS_PART_NAME: C_MOSFET_N_SOT23-C81974-001,MFET,BSS138LT3G,TK0,GENERIC; CDS_LMAN_SYM_OUTLINE: -150,150,150,-150; FP_TECH: TK0; IP: GENERIC; PACK_TYPE: SOT23; ROOM: NONE; OriginalSymbolOrigin: (-175,175); XY: (-1500,3075); VER: 1; ROT: 0; PHYS_PAGE: 270; LOCATION: Q33001; DRAWING: @RVP1_ADL_SB_ADP_S_DDR5_SODIMM_2DPC_LIB.H55_DG2_2DPC(SCH_1):PAGE443; CDS_LIB: local; VARIANT: ?; PCB Footprint: CTK0_SOT23_1400X3040_950_MA; CHIPS_PART_NAME: C_MOSFET_N; CDS_PART_NAME: C_MOSFET_N_SOT23-C81974-001,MFET,BSS138LT3G,TK0,GENERIC; CDS_LOCATION: Q33001
R10097 = RES_2: CDS_PHYS_PART_NAME: RES_2_0402-A93548-624,RES,523K,1%,1/16W,TK2,GENERIC; BOM_USE: STUFF; CDS_LMAN_SYM_OUTLINE: -50,50,50,-50; FP_TECH: TK2; IP: GENERIC; ROOM: NONE; OriginalSymbolOrigin: (-25,75); XY: (-6550,2350); VER: 2; ROT: 0; PHYS_PAGE: 270; LOCATION: R10097; DRAWING: @RVP1_ADL_SB_ADP_S_DDR5_SODIMM_2DPC_LIB.H55_DG2_2DPC(SCH_1):PAGE443; CDS_LIB: discrete_2; VARIANT: ?; PCB Footprint: TK2_SM0402_1050X550_MA; CHIPS_PART_NAME: RES_2; CDS_PART_NAME: RES_2_0402-A93548-624,RES,523K,1%,1/16W,TK2,GENERIC; CDS_LOCATION: R10097
R10278 = C_RES#1: CHIPS_PART_NAME: C_RES; CDS_PHYS_PART_NAME: C_RES_0603-A93550-324,RES,1,1%,0.1W,TK2,GENERIC; CDS_LMAN_SYM_OUTLINE: -50,50,50,-50; FP_TECH: TK2; IP: GENERIC; ROOM: NONE; OriginalSymbolOrigin: (-75,25); XY: (-7000,3350); ROT: 0; PHYS_PAGE: 270; LOCATION: R10278; DRAWING: @RVP1_ADL_SB_ADP_S_DDR5_SODIMM_2DPC_LIB.H55_DG2_2DPC(SCH_1):PAGE443; CDS_LIB: c_discrete; VARIANT: ?; PCB Footprint: CTK2_SM0603_1800X900_MA; VER: 1; CDS_PART_NAME: C_RES_0603-A93550-324,RES,1,1%,0.1W,TK2,GENERIC; CDS_LOCATION: R10278
R10288 = RES#1: CHIPS_PART_NAME: RES; CDS_PHYS_PART_NAME: RES_0402-A93548-478,CHIP,39K,1%,1/16W,LPDB,GENERIC; OriginalSymbolOrigin: (-75,25); XY: (-6775,2500); VER: 1; PHYS_PAGE: 270; LOCATION: R10288; IP: GENERIC; FP_TECH: LPDB; DRAWING: @RVP1_ADL_SB_ADP_S_DDR5_SODIMM_2DPC_LIB.H55_DG2_2DPC(SCH_1):PAGE443; CDS_LIB: discrete; PCB Footprint: SMR0402IA; ROT: 1; CDS_PART_NAME: RES_0402-A93548-478,CHIP,39K,1%,1/16W,LPDB,GENERIC; CDS_LOCATION: R10288
R10347 = C_RES#1: CHIPS_PART_NAME: C_RES; CDS_PHYS_PART_NAME: C_RES_0402-A93549-001,RES,0,5%,0.0625W,TK2,GENERIC; CDS_LMAN_SYM_OUTLINE: -50,50,50,-50; FP_TECH: TK2; IP: GENERIC; ROOM: NONE; OriginalSymbolOrigin: (-75,25); XY: (-6025,2500); VER: 1; PHYS_PAGE: 270; LOCATION: R10347; DRAWING: @RVP1_ADL_SB_ADP_S_DDR5_SODIMM_2DPC_LIB.H55_DG2_2DPC(SCH_1):PAGE443; CDS_LIB: c_discrete; VARIANT: ?; PCB Footprint: CTK2_SM0402_1100X550_MA; ROT: 0; CDS_PART_NAME: C_RES_0402-A93549-001,RES,0,5%,0.0625W,TK2,GENERIC; CDS_LOCATION: R10347
R10348 = RES: CDS_PHYS_PART_NAME: RES_0402-G64084-123,CHIP,100K,1%,1/16W,LPDB,GENERIC; OriginalSymbolOrigin: (-25,75); XY: (-4450,1600); VER: 2; ROT: 0; PHYS_PAGE: 270; LOCATION: R10348; IP: GENERIC; FP_TECH: LPDB; DRAWING: @RVP1_ADL_SB_ADP_S_DDR5_SODIMM_2DPC_LIB.H55_DG2_2DPC(SCH_1):PAGE443; CDS_LIB: discrete; PCB Footprint: SMR0402IA; CHIPS_PART_NAME: RES; CDS_PART_NAME: RES_0402-G64084-123,CHIP,100K,1%,1/16W,LPDB,GENERIC; CDS_LOCATION: R10348
R10353 = RES#1: CHIPS_PART_NAME: RES; CDS_PHYS_PART_NAME: RES_0402-C17927-001,CHIP,0,1%,1/16W,LPDB,GENERIC; OriginalSymbolOrigin: (-75,25); XY: (-3275,2575); VER: 1; PHYS_PAGE: 270; LOCATION: R10353; IP: GENERIC; FP_TECH: LPDB; DRAWING: @RVP1_ADL_SB_ADP_S_DDR5_SODIMM_2DPC_LIB.H55_DG2_2DPC(SCH_1):PAGE443; CDS_LIB: discrete; PCB Footprint: SMR0402IA; ROT: 0; CDS_PART_NAME: RES_0402-C17927-001,CHIP,0,1%,1/16W,LPDB,GENERIC; CDS_LOCATION: R10353
R10355 = RES#1: CHIPS_PART_NAME: RES; CDS_PHYS_PART_NAME: RES_0402-C17927-001,CHIP,0,1%,1/16W,LPDB,GENERIC; OriginalSymbolOrigin: (-75,25); XY: (-2800,1850); VER: 1; PHYS_PAGE: 270; LOCATION: R10355; IP: GENERIC; FP_TECH: LPDB; DRAWING: @RVP1_ADL_SB_ADP_S_DDR5_SODIMM_2DPC_LIB.H55_DG2_2DPC(SCH_1):PAGE443; CDS_LIB: discrete; PCB Footprint: SMR0402IA; ROT: 0; CDS_PART_NAME: RES_0402-C17927-001,CHIP,0,1%,1/16W,LPDB,GENERIC; CDS_LOCATION: R10355
R10356 = RES#1: CHIPS_PART_NAME: RES; CDS_PHYS_PART_NAME: RES_0402-C17927-001,CHIP,0,1%,1/16W,LPDB,GENERIC; OriginalSymbolOrigin: (-75,25); XY: (-2775,2100); VER: 1; PHYS_PAGE: 270; LOCATION: R10356; IP: GENERIC; FP_TECH: LPDB; DRAWING: @RVP1_ADL_SB_ADP_S_DDR5_SODIMM_2DPC_LIB.H55_DG2_2DPC(SCH_1):PAGE443; CDS_LIB: discrete; PCB Footprint: SMR0402IA; ROT: 0; CDS_PART_NAME: RES_0402-C17927-001,CHIP,0,1%,1/16W,LPDB,GENERIC; CDS_LOCATION: R10356
R10360 = RES: CDS_PHYS_PART_NAME: RES_0402-A93548-599,CHIP,10K,1%,1/16W,LPDB,GENERIC; OriginalSymbolOrigin: (-25,75); XY: (-1875,2250); VER: 2; ROT: 0; PHYS_PAGE: 270; LOCATION: R10360; IP: GENERIC; FP_TECH: LPDB; DRAWING: @RVP1_ADL_SB_ADP_S_DDR5_SODIMM_2DPC_LIB.H55_DG2_2DPC(SCH_1):PAGE443; CDS_LIB: discrete; PCB Footprint: SMR0402IA; CHIPS_PART_NAME: RES; CDS_PART_NAME: RES_0402-A93548-599,CHIP,10K,1%,1/16W,LPDB,GENERIC; CDS_LOCATION: R10360
R10362 = RES#1: CHIPS_PART_NAME: RES; CDS_PHYS_PART_NAME: RES_0402-C17927-001,CHIP,0,1%,1/16W,LPDB,GENERIC; OriginalSymbolOrigin: (-75,25); XY: (-1600,1450); VER: 1; PHYS_PAGE: 270; LOCATION: R10362; IP: GENERIC; FP_TECH: LPDB; DRAWING: @RVP1_ADL_SB_ADP_S_DDR5_SODIMM_2DPC_LIB.H55_DG2_2DPC(SCH_1):PAGE443; CDS_LIB: discrete; PCB Footprint: SMR0402IA; ROT: 0; CDS_PART_NAME: RES_0402-C17927-001,CHIP,0,1%,1/16W,LPDB,GENERIC; CDS_LOCATION: R10362
R10363 = RES: CDS_PHYS_PART_NAME: RES_0402-A93548-599,CHIP,10K,1%,1/16W,LPDB,GENERIC; OriginalSymbolOrigin: (-25,75); XY: (-1225,3575); VER: 2; ROT: 0; PHYS_PAGE: 270; LOCATION: R10363; IP: GENERIC; FP_TECH: LPDB; DRAWING: @RVP1_ADL_SB_ADP_S_DDR5_SODIMM_2DPC_LIB.H55_DG2_2DPC(SCH_1):PAGE443; CDS_LIB: discrete; PCB Footprint: SMR0402IA; CHIPS_PART_NAME: RES; CDS_PART_NAME: RES_0402-A93548-599,CHIP,10K,1%,1/16W,LPDB,GENERIC; CDS_LOCATION: R10363
R10364 = RES: CDS_PHYS_PART_NAME: RES_0402-A93548-599,EMPTY,10K,1%,1/16W,LPDB,GENERIC; OriginalSymbolOrigin: (-25,75); XY: (-1400,1875); VER: 2; ROT: 0; PHYS_PAGE: 270; LOCATION: R10364; IP: GENERIC; FP_TECH: LPDB; DRAWING: @RVP1_ADL_SB_ADP_S_DDR5_SODIMM_2DPC_LIB.H55_DG2_2DPC(SCH_1):PAGE443; CDS_LIB: discrete; PCB Footprint: SMR0402IA; CHIPS_PART_NAME: RES; CDS_PART_NAME: RES_0402-A93548-599,EMPTY,10K,1%,1/16W,LPDB,GENERIC; CDS_LOCATION: R10364
R10365 = RES: CDS_PHYS_PART_NAME: RES_0402-A93548-599,EMPTY,10K,1%,1/16W,LPDB,GENERIC; OriginalSymbolOrigin: (-25,75); XY: (-1150,3175); VER: 2; ROT: 0; PHYS_PAGE: 270; LOCATION: R10365; IP: GENERIC; FP_TECH: LPDB; DRAWING: @RVP1_ADL_SB_ADP_S_DDR5_SODIMM_2DPC_LIB.H55_DG2_2DPC(SCH_1):PAGE443; CDS_LIB: discrete; PCB Footprint: SMR0402IA; CHIPS_PART_NAME: RES; CDS_PART_NAME: RES_0402-A93548-599,EMPTY,10K,1%,1/16W,LPDB,GENERIC; CDS_LOCATION: R10365
R32801 = C_RES_4TERM: CDS_PHYS_PART_NAME: C_RES_4TERM_0805_SM-H19668-001,RES,0.005,1%,0.5W,TK2,GENERIC; CDS_LMAN_SYM_OUTLINE: -50,50,50,-50; FP_TECH: TK2; IP: GENERIC; ROOM: NONE; OriginalSymbolOrigin: (-75,25); XY: (-2025,4350); VER: 1; ROT: 0; PHYS_PAGE: 270; LOCATION: R32801; DRAWING: @RVP1_ADL_SB_ADP_S_DDR5_SODIMM_2DPC_LIB.H55_DG2_2DPC(SCH_1):PAGE443; CDS_LIB: c_discrete; VARIANT: ?; PCB Footprint: CTK2_SMR4_0805_2150X1350_MA; CHIPS_PART_NAME: C_RES_4TERM; CDS_PART_NAME: C_RES_4TERM_0805_SM-H19668-001,RES,0.005,1%,0.5W,TK2,GENERIC; CDS_LOCATION: R32801
R32802 = RES#1: PART_NUMBER: A93549-171; CHIPS_PART_NAME: RES; CDS_PHYS_PART_NAME: RES_0402-A93549-171,CHIP,1.8K,5%,1/16W,LPDB,GENERIC; OriginalSymbolOrigin: (-75,25); XY: (-4225,2550); VER: 1; ROT: 0; PHYS_PAGE: 270; LOCATION: R32802; IP: GENERIC; FP_TECH: LPDB; DRAWING: @RVP1_ADL_SB_ADP_S_DDR5_SODIMM_2DPC_LIB.H55_DG2_2DPC(SCH_1):PAGE443; CDS_LIB: discrete; PCB Footprint: SMR1005MD; CDS_PART_NAME: RES_0402-A93549-171,CHIP,1.8K,5%,1/16W,LPDB,GENERIC; CDS_LOCATION: R32802
R33001 = RES#1: CHIPS_PART_NAME: RES; CDS_PHYS_PART_NAME: RES_0402-C17927-001,CHIP,0,1%,1/16W,LPDB,GENERIC; OriginalSymbolOrigin: (-75,25); XY: (-2575,3075); VER: 1; PHYS_PAGE: 270; LOCATION: R33001; IP: GENERIC; FP_TECH: LPDB; DRAWING: @RVP1_ADL_SB_ADP_S_DDR5_SODIMM_2DPC_LIB.H55_DG2_2DPC(SCH_1):PAGE443; CDS_LIB: discrete; PCB Footprint: SMR0402IA; ROT: 0; CDS_PART_NAME: RES_0402-C17927-001,CHIP,0,1%,1/16W,LPDB,GENERIC; CDS_LOCATION: R33001
R33002 = RES#1: CHIPS_PART_NAME: RES; CDS_PHYS_PART_NAME: RES_0402-C17927-001,EMPTY,0,1%,1/16W,LPDB,GENERIC; OriginalSymbolOrigin: (-75,25); XY: (-1800,3375); VER: 1; PHYS_PAGE: 270; LOCATION: R33002; IP: GENERIC; FP_TECH: LPDB; DRAWING: @RVP1_ADL_SB_ADP_S_DDR5_SODIMM_2DPC_LIB.H55_DG2_2DPC(SCH_1):PAGE443; CDS_LIB: discrete; PCB Footprint: SMR0402IA; ROT: 0; CDS_PART_NAME: RES_0402-C17927-001,EMPTY,0,1%,1/16W,LPDB,GENERIC; CDS_LOCATION: R33002
U10349 = APW8751_2: CDS_PHYS_PART_NAME: APW8751_2_LCC-K93407-001,IC,APW8751QBITRG,TK0,GENERIC; CDS_LMAN_SYM_OUTLINE: -250,600,250,-600; FP_TECH: TK0; IP: GENERIC; PACK_TYPE: LCC; ROOM: NONE; OriginalSymbolOrigin: (-275,600); XY: (-5125,2550); VER: 1; ROT: 0; PHYS_PAGE: 270; LOCATION: U10349; DRAWING: @RVP1_ADL_SB_ADP_S_DDR5_SODIMM_2DPC_LIB.H55_DG2_2DPC(SCH_1):PAGE443; CDS_LIB: local; VARIANT: ?; PCB Footprint: TK0_LCC24_S4100_500_DFS2650_MA; SEC_TYPE: LCC; CHIPS_PART_NAME: APW8751_2; CDS_PART_NAME: APW8751_2_LCC-K93407-001,IC,APW8751QBITRG,TK0,GENERIC; CDS_LOCATION: U10349